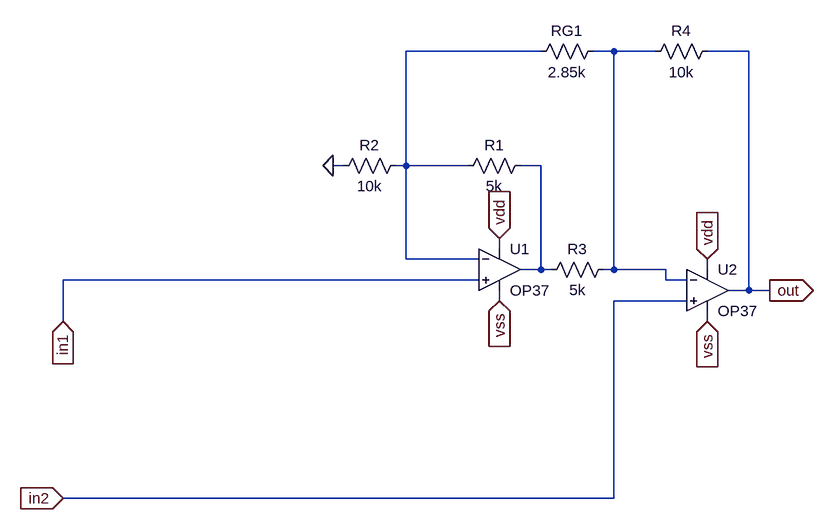
[diagram p0: schematic etj1.asc]
etj1.asc, the LTspice schematic file:
Version 4
SHEET 1 1424 712
WIRE 976 -48 768 -48
WIRE 1088 -48 1056 -48
WIRE 1152 -48 1088 -48
WIRE 1296 -48 1232 -48
WIRE 672 128 656 128
WIRE 768 128 768 -48
WIRE 768 128 752 128
WIRE 864 128 768 128
WIRE 976 128 944 128
WIRE 912 256 912 240
WIRE 768 272 768 128
WIRE 880 272 768 272
WIRE 976 288 976 128
WIRE 976 288 944 288
WIRE 992 288 976 288
WIRE 1088 288 1088 -48
WIRE 1088 288 1072 288
WIRE 1168 288 1088 288
WIRE 1232 288 1232 272
WIRE 880 304 240 304
WIRE 1168 304 1168 288
WIRE 1200 304 1168 304
WIRE 1296 320 1296 -48
WIRE 1296 320 1264 320
WIRE 1328 320 1296 320
WIRE 912 336 912 320
WIRE 1200 336 1088 336
WIRE 240 368 240 304
WIRE 1232 368 1232 352
WIRE 1088 640 1088 336
WIRE 1088 640 240 640
FLAG 656 128 0
FLAG 240 368 in1
IOPIN 240 368 In
FLAG 240 640 in2
IOPIN 240 640 In
FLAG 1328 320 out
IOPIN 1328 320 Out
FLAG 912 240 vdd
IOPIN 912 240 In
FLAG 1232 272 vdd
IOPIN 1232 272 In
FLAG 912 336 vss
IOPIN 912 336 In
FLAG 1232 368 vss
IOPIN 1232 368 In
SYMBOL res 960 112 R90
WINDOW 0 0 56 VBottom 2
WINDOW 3 32 56 VTop 2
SYMATTR InstName R1
SYMATTR Value 5k
SYMBOL res 768 112 R90
WINDOW 0 0 56 VBottom 2
WINDOW 3 32 56 VTop 2
SYMATTR InstName R2
SYMATTR Value 10k
SYMBOL res 1072 -64 R90
WINDOW 0 0 56 VBottom 2
WINDOW 3 32 56 VTop 2
SYMATTR InstName RG1
SYMATTR Value 2.85k
SYMBOL res 1088 272 R90
WINDOW 0 0 56 VBottom 2
WINDOW 3 32 56 VTop 2
SYMATTR InstName R3
SYMATTR Value 5k
SYMBOL res 1248 -64 R90
WINDOW 0 0 56 VBottom 2
WINDOW 3 32 56 VTop 2
SYMATTR InstName R4
SYMATTR Value 10k
SYMBOL OpAmps\\OP37 912 224 R0
SYMATTR InstName U1
SYMBOL OpAmps\\OP37 1232 256 R0
SYMATTR InstName U2

The netlist it stands for:
* etj1.asc
R1 N003 N001 5k
R2 N001 0 10k
RG1 N002 N001 2.85k
R3 N002 N003 5k
R4 out N002 10k
XU1 in1 N001 vdd vss N003 LT1037  ; OP37, pins In+ In- V+ V- OUT
XU2 in2 N002 vdd vss out LT1037  ; OP37, pins In+ In- V+ V- OUT
.lib LTC.lib
.backanno
.end